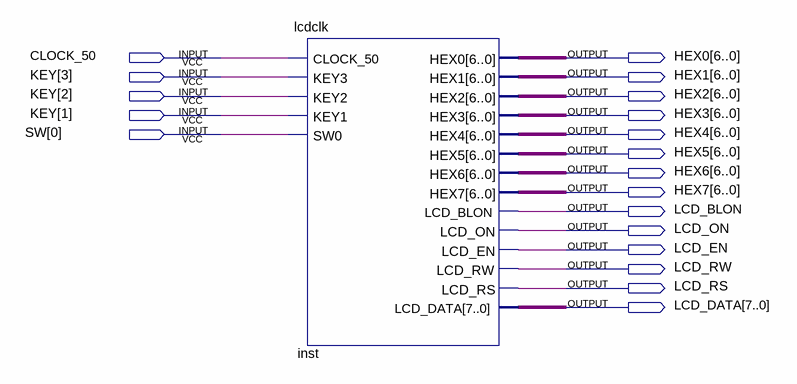
[diagram p0: schematic sheet]
// Quartus schematic lcd_clock.bdf as structural Verilog: 1 symbols, 19 pins
module lcd_clock (
  input  CLOCK_50,
  input  [3:1] KEY,
  input  [0:0] SW,
  output [6:0] HEX0,
  output [6:0] HEX1,
  output [6:0] HEX2,
  output [6:0] HEX3,
  output [6:0] HEX4,
  output [6:0] HEX5,
  output [6:0] HEX6,
  output [6:0] HEX7,
  output LCD_BLON,
  output LCD_ON,
  output LCD_EN,
  output LCD_RW,
  output LCD_RS,
  output [7:0] LCD_DATA
);

  lcdclk inst (
    .CLOCK_50(CLOCK_50), .KEY3(KEY[3]), .KEY2(KEY[2]), .KEY1(KEY[1]), .SW0(SW[0]), .HEX0(HEX0), .HEX1(HEX1),
    .HEX2(HEX2), .HEX3(HEX3), .HEX4(HEX4), .HEX5(HEX5), .HEX6(HEX6), .HEX7(HEX7), .LCD_BLON(LCD_BLON),
    .LCD_ON(LCD_ON), .LCD_EN(LCD_EN), .LCD_RW(LCD_RW), .LCD_RS(LCD_RS), .LCD_DATA(LCD_DATA));
endmodule
